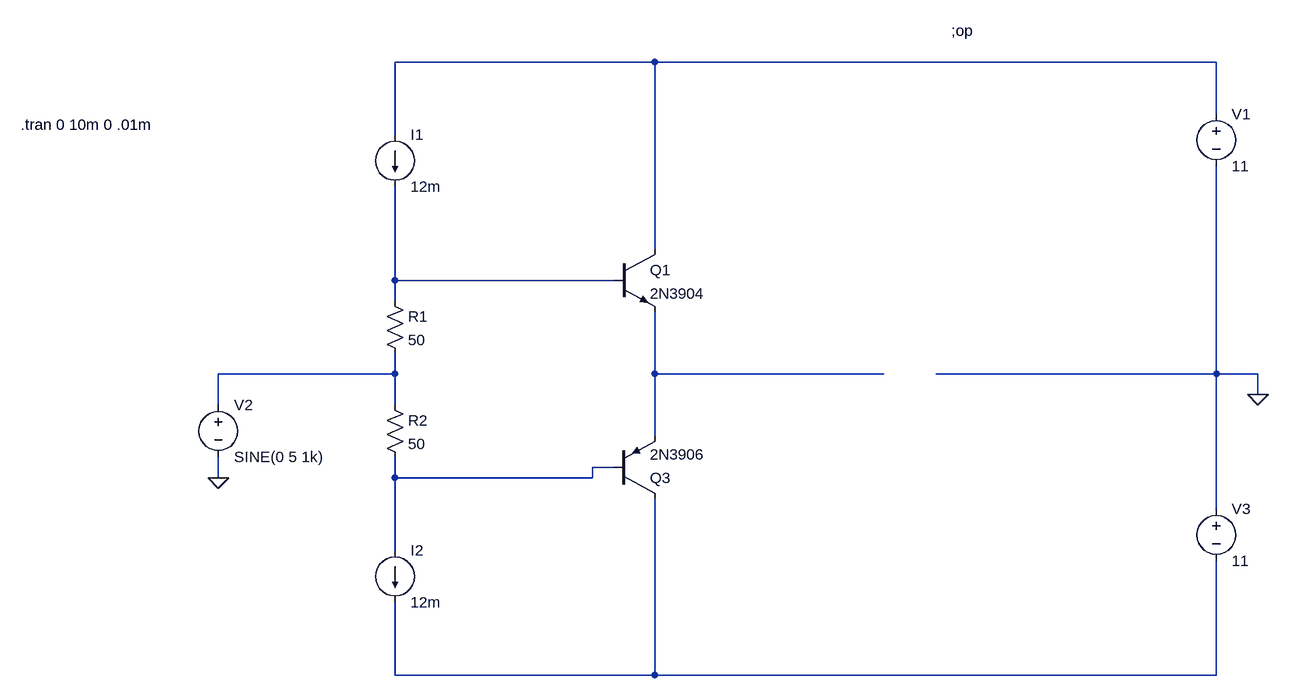
[diagram p0: schematic claseb2017x.asc]
claseb2017x.asc, the LTspice schematic file:
Version 4
SHEET 1 1748 680
WIRE 544 -640 144 -640
WIRE 1408 -640 544 -640
WIRE 1408 -560 1408 -640
WIRE 144 -528 144 -640
WIRE 544 -352 544 -640
WIRE 144 -304 144 -448
WIRE 224 -304 144 -304
WIRE 480 -304 224 -304
WIRE 144 -272 144 -304
WIRE 144 -160 144 -192
WIRE 144 -160 -128 -160
WIRE 544 -160 544 -256
WIRE 592 -160 544 -160
WIRE 896 -160 592 -160
WIRE 1408 -160 1408 -480
WIRE 1408 -160 976 -160
WIRE 1472 -160 1408 -160
WIRE 1472 -128 1472 -160
WIRE -128 -112 -128 -160
WIRE 144 -112 144 -160
WIRE 544 -64 544 -160
WIRE 480 -16 448 -16
WIRE -128 0 -128 -32
WIRE 144 0 144 -32
WIRE 352 0 144 0
WIRE 448 0 448 -16
WIRE 448 0 352 0
WIRE 1408 48 1408 -160
WIRE 144 112 144 0
WIRE 144 304 144 192
WIRE 544 304 544 32
WIRE 544 304 144 304
WIRE 1408 304 1408 128
WIRE 1408 304 544 304
FLAG 1472 -128 0
FLAG -128 0 0
DATAFLAG 592 -160 ""
DATAFLAG 224 -304 ""
DATAFLAG 352 0 ""
SYMBOL voltage 1408 -576 R0
WINDOW 123 0 0 Left 2
WINDOW 39 0 0 Left 2
SYMATTR InstName V1
SYMATTR Value 11
SYMBOL voltage -128 -128 R0
WINDOW 123 0 0 Left 2
WINDOW 39 0 0 Left 2
SYMATTR InstName V2
SYMATTR Value SINE(0 5 1k)
SYMBOL npn 480 -352 R0
SYMATTR InstName Q1
SYMATTR Value 2N3904
SYMBOL pnp 480 32 M180
SYMATTR InstName Q3
SYMATTR Value 2N3906
SYMBOL voltage 1408 32 R0
WINDOW 123 0 0 Left 2
WINDOW 39 0 0 Left 2
SYMATTR InstName V3
SYMATTR Value 11
SYMBOL current 144 -528 R0
WINDOW 123 0 0 Left 2
WINDOW 39 0 0 Left 2
SYMATTR InstName I1
SYMATTR Value 12m
SYMBOL current 144 112 R0
WINDOW 123 0 0 Left 2
WINDOW 39 0 0 Left 2
SYMATTR InstName I2
SYMATTR Value 12m
SYMBOL res 128 -288 R0
SYMATTR InstName R1
SYMATTR Value 50
SYMBOL res 128 -128 R0
SYMATTR InstName R2
SYMATTR Value 50
TEXT 1000 -688 Left 2 !;op
TEXT -432 -544 Left 2 !.tran 0 10m 0 .01m

The netlist it stands for:
* claseb2017x.asc
V1 N001 0 11
V2 N003 0 SINE(0 5 1k)
Q1 N001 N002 N004 0 2N3904
Q3 N006 N005 N004 0 2N3906
V3 0 N006 11
I1 N001 N002 12m
I2 N005 N006 12m
R1 N002 N003 50
R2 N003 N005 50
.model NPN NPN
.model PNP PNP
.lib standard.bjt
;op
.tran 0 10m 0 .01m
.backanno
.end